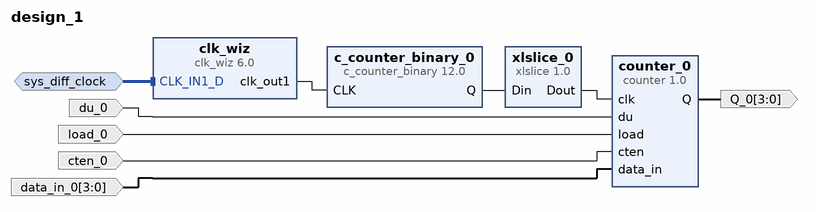
[diagram p0: block diagram of the top level]
# Vivado block design design_1, xc7a200tfbg676-2, Vivado 2018.2
create_bd_design design_1

create_bd_intf_port -mode Slave -vlnv xilinx.com:interface:diff_clock_rtl:1.0 sys_diff_clock
set_property -dict {CONFIG.FREQ_HZ 200000000} [get_bd_intf_ports sys_diff_clock]
create_bd_port -dir I du_0
create_bd_port -dir I load_0
create_bd_port -dir I cten_0
create_bd_port -dir I -from 3 -to 0 data_in_0
create_bd_port -dir O -from 3 -to 0 Q_0

create_bd_cell -type ip -vlnv xilinx.com:ip:c_counter_binary:12.0 c_counter_binary_0
set_property -dict {CONFIG.Output_Width 26} [get_bd_cells c_counter_binary_0]
create_bd_cell -type ip -vlnv xilinx.com:ip:clk_wiz:6.0 clk_wiz
set_property -dict [list \
  CONFIG.PRIM_SOURCE Differential_clock_capable_pin \
  CONFIG.USE_LOCKED false \
  CONFIG.USE_RESET false \
  CONFIG.USE_BOARD_FLOW true \
  CONFIG.CLK_IN1_BOARD_INTERFACE sys_diff_clock \
] [get_bd_cells clk_wiz]
create_bd_cell -type ip -vlnv xilinx.com:user:counter:1.0 counter_0
create_bd_cell -type ip -vlnv xilinx.com:ip:xlslice:1.0 xlslice_0
set_property -dict {CONFIG.DIN_TO 25 CONFIG.DIN_FROM 25 CONFIG.DIN_WIDTH 26 CONFIG.DOUT_WIDTH 1} [get_bd_cells xlslice_0]

# ---- connections ----

connect_bd_intf_net [get_bd_intf_ports sys_diff_clock] [get_bd_intf_pins clk_wiz/CLK_IN1_D]
connect_bd_net [get_bd_pins clk_wiz/clk_out1] [get_bd_pins c_counter_binary_0/CLK]
connect_bd_net [get_bd_pins c_counter_binary_0/Q] [get_bd_pins xlslice_0/Din]
connect_bd_net [get_bd_pins xlslice_0/Dout] [get_bd_pins counter_0/clk]
connect_bd_net -net du_0_1 [get_bd_ports du_0] [get_bd_pins counter_0/du]
connect_bd_net -net load_0_1 [get_bd_ports load_0] [get_bd_pins counter_0/load]
connect_bd_net -net cten_0_1 [get_bd_ports cten_0] [get_bd_pins counter_0/cten]
connect_bd_net -net data_in_0_1 [get_bd_ports data_in_0] [get_bd_pins counter_0/data_in]
connect_bd_net [get_bd_pins counter_0/Q] [get_bd_ports Q_0]

validate_bd_design
save_bd_design
